# EAGLE design JouleMeter_new (EAGLE 6.2)
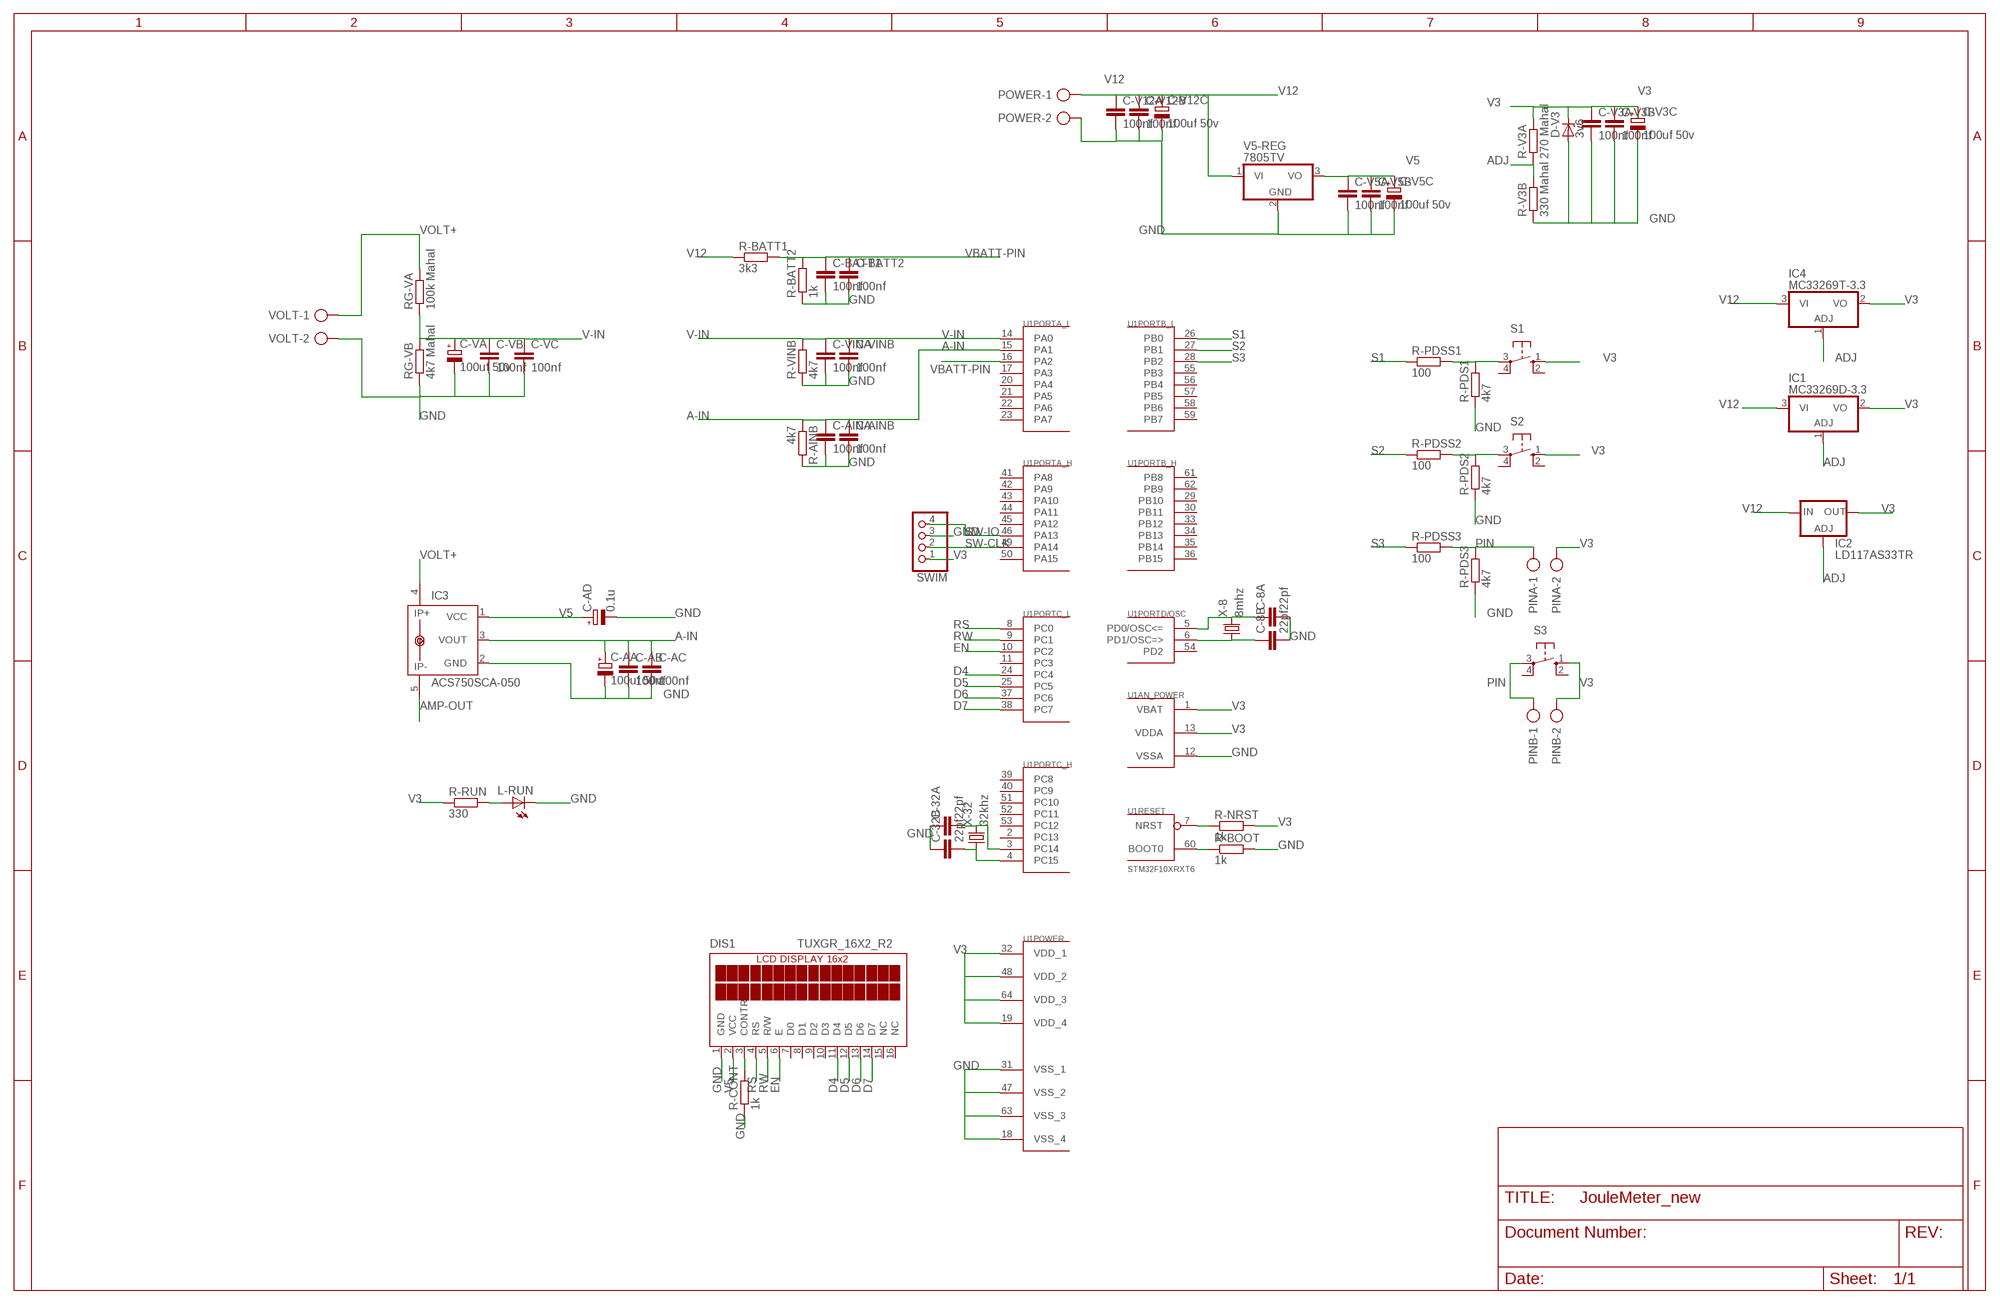
[diagram p0: schematic, sheet 1]

## Parts
C-8A  22pf  C-EU025-024X044  [C025-024X044]
C-8B  22pf  C-EU025-024X044  [C025-024X044]
C-32A  22pf  C-EU025-024X044  [C025-024X044]
C-32B  22pf  C-EU025-024X044  [C025-024X044]
C-AA  100uf 50v  CPOL-EUE2-5  [E2-5]
C-AB  100nf  C-EU050-024X044  [C050-024X044]
C-AC  100nf  C-EU050-024X044  [C050-024X044]
C-AD  0.1u  CPOL-EUE2-5  [E2-5]
C-AINA  100nf  C-EU050-024X044  [C050-024X044]
C-AINB  100nf  C-EU050-024X044  [C050-024X044]
C-BATT1  100nf  C-EU050-024X044  [C050-024X044]
C-BATT2  100nf  C-EU050-024X044  [C050-024X044]
C-V3A  100nf  C-EU050-024X044  [C050-024X044]
C-V3B  100nf  C-EU050-024X044  [C050-024X044]
C-V3C  100uf 50v  CPOL-EUE5-5  [E5-5]
C-V5A  100nf  C-EU050-024X044  [C050-024X044]
C-V5B  100nf  C-EU050-024X044  [C050-024X044]
C-V5C  100uf 50v  CPOL-EUE5-5  [E5-5]
C-V12A  100nf  C-EU050-024X044  [C050-024X044]
C-V12B  100nf  C-EU050-024X044  [C050-024X044]
C-V12C  100uf 50v  CPOL-EUE5-5  [E5-5]
C-VA  100uf 50v  CPOL-EUE2-5  [E2-5]
C-VB  100nf  C-EU050-024X044  [C050-024X044]
C-VC  100nf  C-EU050-024X044  [C050-024X044]
C-VINA  100nf  C-EU050-024X044  [C050-024X044]
C-VINB  100nf  C-EU050-024X044  [C050-024X044]
D-V3  3v6  ZENER-DIODEZD-7.5  [ZDIO-7.5]
DIS1  TUXGR_16X2_R2  [TUXGR_16X2_R2]
IC1  MC33269D-3.3  [DPACK]
IC2  LD117AS33TR  [SOT223]
IC3  ACS750SCA-050  [ACS75050]
IC4  MC33269T-3.3  [TO220V]
L-RUN  LED3MM  [LED3MM]
PINA  AK300/2  [AK300/2]
PINB  AK300/2  [AK300/2]
POWER  AK300/2  [AK300/2]
R-AINB  4k7  R-EU_0204/7  [0204/7]
R-BATT1  3k3  R-EU_0204/7  [0204/7]
R-BATT2  1k  R-EU_0204/7  [0204/7]
R-BOOT  1k  R-EU_0204/7  [0204/7]
R-CONT  1k  R-EU_0204/7  [0204/7]
R-NRST  1k  R-EU_0204/7  [0204/7]
R-PDS1  4k7  R-EU_0204/7  [0204/7]
R-PDS2  4k7  R-EU_0204/7  [0204/7]
R-PDS3  4k7  R-EU_0204/7  [0204/7]
R-PDSS1  100  R-EU_0204/7  [0204/7]
R-PDSS2  100  R-EU_0204/7  [0204/7]
R-PDSS3  100  R-EU_0204/7  [0204/7]
R-RUN  330  R-EU_0204/7  [0204/7]
R-V3A  270 Mahal  R-EU_0204/7  [0204/7]
R-V3B  330 Mahal  R-EU_0204/7  [0204/7]
R-VINB  4k7  R-EU_0204/7  [0204/7]
RG-VA  100k Mahal  R-EU_0204/7  [0204/7]
RG-VB  4k7 Mahal  R-EU_0204/7  [0204/7]
S1  10-XX  [B3F-10XX]
S2  10-XX  [B3F-10XX]
S3  40-XX  [B3F-40XX]
SWIM  PINHD-1X4  [1X04]
U1  STM32F10XRXT6  [TQFP64]
V5-REG  7805TV  [TO220V]
VOLT  AK300/2  [AK300/2]
X-8  8mhz  CRYSTALHC49U-V  [HC49U-V]
X-32  32khz  CRYSTALTC26V  [TC26V]

## Nets
A-IN: C-AA.+ C-AB.1 C-AC.1 C-AINA.1 C-AINB.1 IC3.3(VOUT) R-AINB.1 U1.15(PORTA_L:PA1)
ADJ: IC1.1(ADJ) IC2.1(ADJ) IC4.1(ADJ) R-V3A.1 R-V3B.2
AMP-OUT: IC3.5(IP-)
D4: DIS1.11(D4) U1.24(PORTC_L:PC4)
D5: DIS1.12(D5) U1.25(PORTC_L:PC5)
D6: DIS1.13(D6) U1.37(PORTC_L:PC6)
D7: DIS1.14(D7) U1.38(PORTC_L:PC7)
EN: DIS1.6(E) U1.10(PORTC_L:PC2)
GND: C-8A.2 C-8B.2 C-32A.1 C-32B.1 C-AA.- C-AB.2 C-AC.2 C-AD.- C-AINA.2 C-AINB.2 C-BATT1.2 C-BATT2.2 C-V3A.2 C-V3B.2 C-V3C.- C-V5A.2 C-V5B.2 C-V5C.- C-V12A.2 C-V12B.2 C-V12C.- C-VA.- C-VB.2 C-VC.2 C-VINA.2 C-VINB.2 D-V3.A DIS1.1(GND) IC3.2(GND) L-RUN.K(C) POWER.2 R-AINB.2 R-BATT2.1 R-BOOT.2 R-CONT.1 R-PDS1.1 R-PDS2.1 R-PDS3.1 R-V3B.1 R-VINB.1 RG-VB.1 SWIM.3 U1.12(AN_POWER:VSSA) U1.18(POWER:VSS_4) U1.31(POWER:VSS_1) U1.47(POWER:VSS_2) U1.63(POWER:VSS_3) V5-REG.2(GND) VOLT.2
N$3: R-PDS1.2 R-PDSS1.2 S1.3(P)
N$4: R-PDS2.2 R-PDSS2.2 S2.3(P)
N$8: DIS1.3(CONTR) R-CONT.2
N$29: C-32B.2 U1.4(PORTC_H:PC15) X-32.1
N$30: C-32A.2 U1.3(PORTC_H:PC14) X-32.2
N$34: C-8B.1 U1.6(PORTD/OSC:PD1/OSC=>) X-8.1
N$36: C-8A.1 U1.5(PORTD/OSC:PD0/OSC<=) X-8.2
N$41: R-NRST.1 U1.7(RESET:NRST)
N$42: R-BOOT.1 U1.60(RESET:BOOT0)
N$72: L-RUN.A R-RUN.2
PIN: PINA.1 PINB.1 R-PDS3.2 R-PDSS3.2 S3.3(P)
RS: DIS1.4(RS) U1.8(PORTC_L:PC0)
RW: DIS1.5(R/W) U1.9(PORTC_L:PC1)
S1: R-PDSS1.1 U1.26(PORTB_L:PB0)
S2: R-PDSS2.1 U1.27(PORTB_L:PB1)
S3: R-PDSS3.1 U1.28(PORTB_L:PB2)
SW-CLK: SWIM.2 U1.49(PORTA_H:PA14)
SW-IO: SWIM.4 U1.46(PORTA_H:PA13)
V3: C-V3A.1 C-V3B.1 C-V3C.+ D-V3.C IC1.2(VO) IC2.4(OUT) IC4.2(VO) PINA.2 PINB.2 R-NRST.2 R-RUN.1 R-V3A.2 S1.1(S) S2.1(S) S3.1(S) SWIM.1 U1.1(AN_POWER:VBAT) U1.13(AN_POWER:VDDA) U1.19(POWER:VDD_4) U1.32(POWER:VDD_1) U1.48(POWER:VDD_2) U1.64(POWER:VDD_3)
V5: C-AD.+ C-V5A.1 C-V5B.1 C-V5C.+ DIS1.2(VCC) IC3.1(VCC) V5-REG.3(VO)
V12: C-V12A.1 C-V12B.1 C-V12C.+ IC1.3(VI) IC2.3(IN) IC4.3(VI) POWER.1 R-BATT1.1 V5-REG.1(VI)
V-IN: C-VA.+ C-VB.1 C-VC.1 C-VINA.1 C-VINB.1 R-VINB.2 RG-VA.1 RG-VB.2 U1.14(PORTA_L:PA0)
VBATT-PIN: C-BATT1.1 C-BATT2.1 R-BATT1.2 R-BATT2.2 U1.16(PORTA_L:PA2)
VOLT+: IC3.4(IP+) RG-VA.2 VOLT.1
Unconnected: DIS1.7(D0) DIS1.8(D1) DIS1.9(D2) DIS1.10(D3) DIS1.15(NC) DIS1.16(NC) IC3.IP+1 IC3.IP-1 S1.2(S1) S1.4(P1) S2.2(S1) S2.4(P1) S3.2(S1) S3.4(P1) U1.2(PORTC_H:PC13) U1.11(PORTC_L:PC3) U1.17(PORTA_L:PA3) U1.20(PORTA_L:PA4) U1.21(PORTA_L:PA5) U1.22(PORTA_L:PA6) U1.23(PORTA_L:PA7) U1.29(PORTB_H:PB10) U1.30(PORTB_H:PB11) U1.33(PORTB_H:PB12) U1.34(PORTB_H:PB13) U1.35(PORTB_H:PB14) U1.36(PORTB_H:PB15) U1.39(PORTC_H:PC8) U1.40(PORTC_H:PC9) U1.41(PORTA_H:PA8) U1.42(PORTA_H:PA9) U1.43(PORTA_H:PA10) U1.44(PORTA_H:PA11) U1.45(PORTA_H:PA12) U1.50(PORTA_H:PA15) U1.51(PORTC_H:PC10) U1.52(PORTC_H:PC11) U1.53(PORTC_H:PC12) U1.54(PORTD/OSC:PD2) U1.55(PORTB_L:PB3) U1.56(PORTB_L:PB4) U1.57(PORTB_L:PB5) U1.58(PORTB_L:PB6) U1.59(PORTB_L:PB7) U1.61(PORTB_H:PB8) U1.62(PORTB_H:PB9)

## Library data of the parts
C-8A C-8B C-32A C-32B C-AB C-AC C-AINA C-AINB C-BATT1 C-BATT2 C-V3A C-V3B C-V5A C-V5B C-V12A C-V12B C-VB C-VC C-VINA C-VINB = resistor:C-EU: CAPACITOR, European symbol
C-AA C-AD C-V3C C-V5C C-V12C C-VA = resistor:CPOL-EU: POLARIZED CAPACITOR, European symbol
D-V3 = diode:ZENER-DIODE: Z-Diode
DIS1 = display-lcd:TUXGR_16X2_R2: Tuxgraphics LCD display 16x2 characters reflective, without background light Source: tuxgr_12x2_r2.pdf; OC_FARNELL: unknown; OC_NEWARK: unknown
IC1 IC4 = linear:MC33269?*: Adjustable Output Low Dropout Voltage Regulator 800 mA Source: http://www.onsemi.com/pub/Collateral/MC33269-D.PDF
IC2 = v-reg:LD117A?*: Low drop fixed and adjustable positive voltage regulators 1 A Source: http://www.st.com/stonline/products/literature/ds/7194/ld1117axx.pdf
IC3 = allegro:ACS750*CA-050: Current Sensor display layer 49 Reference in BRD and place VIAs on circles Source: www.allegromicro.com/datafile/0750-050.pdf; MF: ALLEGRO MICROSYSTEMS, INC.; MPN: ACS750SCA-050; OC_FARNELL: 1457175; OC_NEWARK: 81H6588
L-RUN = led:LED: LED OSRAM: - CHIPLED LG R971, LG N971, LY N971, LG Q971, LY Q971, LO R971, LY R971 LH N974, LH R974 LS Q976, LO Q976, LY Q976 LO Q996 - Hyper CHIPLED LW Q18S LB Q993, LB Q99A, LB R99A - SideLED LS A670, LO A670, LY A670, LG A670, LP A670 LB A673, LV A673, LT A673, LW A673 LH A674 LY A675 LS A676, LA A676, LO A676, LY A676, LW A676 LS A679, LY A679, LG A679 - Hyper Micro SIDELED® LS Y876, LA Y876, LO Y876, LY Y876 LT Y87S - SmartLED LW L88C, LW L88S LB L89C, LB L89S, LG L890 LS L89K, LO L89K, LY L89K LS L896, LA L896, LO L896, LY L896 - TOPLED LS T670, LO T670, LY T670, LG T670, LP T670 LSG T670, LSP T670, LSY T670, LOP T670, LYG T670 LG T671, LOG T671, LSG T671 LB T673, LV T673, LT T673, LW T673 LH T674 LS T676, LA T676, LO T676, LY T676, LB T676, LH T676, LSB T676, LW T676 LB T67C, LV T67C, LT T67C, LS T67K, LO T67K, LY T67K, LW E67C LS E67B, LA E67B, LO E67B, LY E67B, LB E67C, LV E67C, LT E67C LW T67C LS T679, LY T679, LG T679 LS T770, LO T770, LY T770, LG T770, LP T770 LB T773, LV T773, LT T773, LW T773 LH T774 LS E675, LA E675, LY E675, LS T675 LS T776, LA T776, LO T776, LY T776, LB T776 LHGB T686 LT T68C, LB T68C - Hyper Mini TOPLED® LB M676 - Mini TOPLED Santana® LG M470 LS M47K, LO M47K, LY M47K Source: http://www.osram.convergy.de LUXEON: - LUMILED® LXK2-PW12-R00, LXK2-PW12-S00, LXK2-PW14-U00, LXK2-PW14-V00 LXK2-PM12-R00, LXK2-PM12-S00, LXK2-PM14-U00 LXK2-PE12-Q00, LXK2-PE12-R00, LXK2-PE12-S00, LXK2-PE14-T00, LXK2-PE14-U00 LXK2-PB12-K00, LXK2-PB12-L00, LXK2-PB12-M00, LXK2-PB14-N00, LXK2-PB14-P00, LXK2-PB14-Q00 LXK2-PR12-L00, LXK2-PR12-M00, LXK2-PR14-Q00, LXK2-PR14-R00 LXK2-PD12-Q00, LXK2-PD12-R00, LXK2-PD12-S00 LXK2-PH12-R00, LXK2-PH12-S00 LXK2-PL12-P00, LXK2-PL12-Q00, LXK2-PL12-R00 Source: www.luxeon.com KINGBRIGHT: KA-3528ASYC Source: www.kingbright.com
PINA PINB POWER VOLT = con-ptr500:AK300/2: CONNECTOR; OC_FARNELL: unknown; OC_NEWARK: unknown
R-AINB R-BATT1 R-BATT2 R-BOOT R-CONT R-NRST R-PDS1-R-PDS3 R-PDSS1-R-PDSS3 R-RUN R-V3A R-V3B R-VINB RG-VA RG-VB = resistor:R-EU_: RESISTOR, European symbol
S1 S2 = switch-omron:10-XX: OMRON SWITCH; MPN: B3F-1000; OC_FARNELL: 176432; OC_NEWARK: 36M3542
S3 = switch-omron:40-XX: OMRON SWITCH; MF: OMRON COMPONENTS USA; MPN: B3F-4000; OC_FARNELL: 176434; OC_NEWARK: 36K3105
SWIM = pinhead:PINHD-1X4: PIN HEADER
U1 = stm32:STM32F10XRXT6: STM32F101/103 64pin LQFP
V5-REG = linear:78*: Positive VOLTAGE REGULATOR Source: http://cache.national.com/ds/LM/LM78L05.pdf http://www.fairchildsemi.com/ds/LM/LM7805.pdf
X-8 = crystal:CRYSTAL: CRYSTAL; OC_FARNELL: 1666969; OC_NEWARK: unknown
X-32 = crystal:CRYSTAL: CRYSTAL; OC_FARNELL: unknown; OC_NEWARK: unknown

## Board
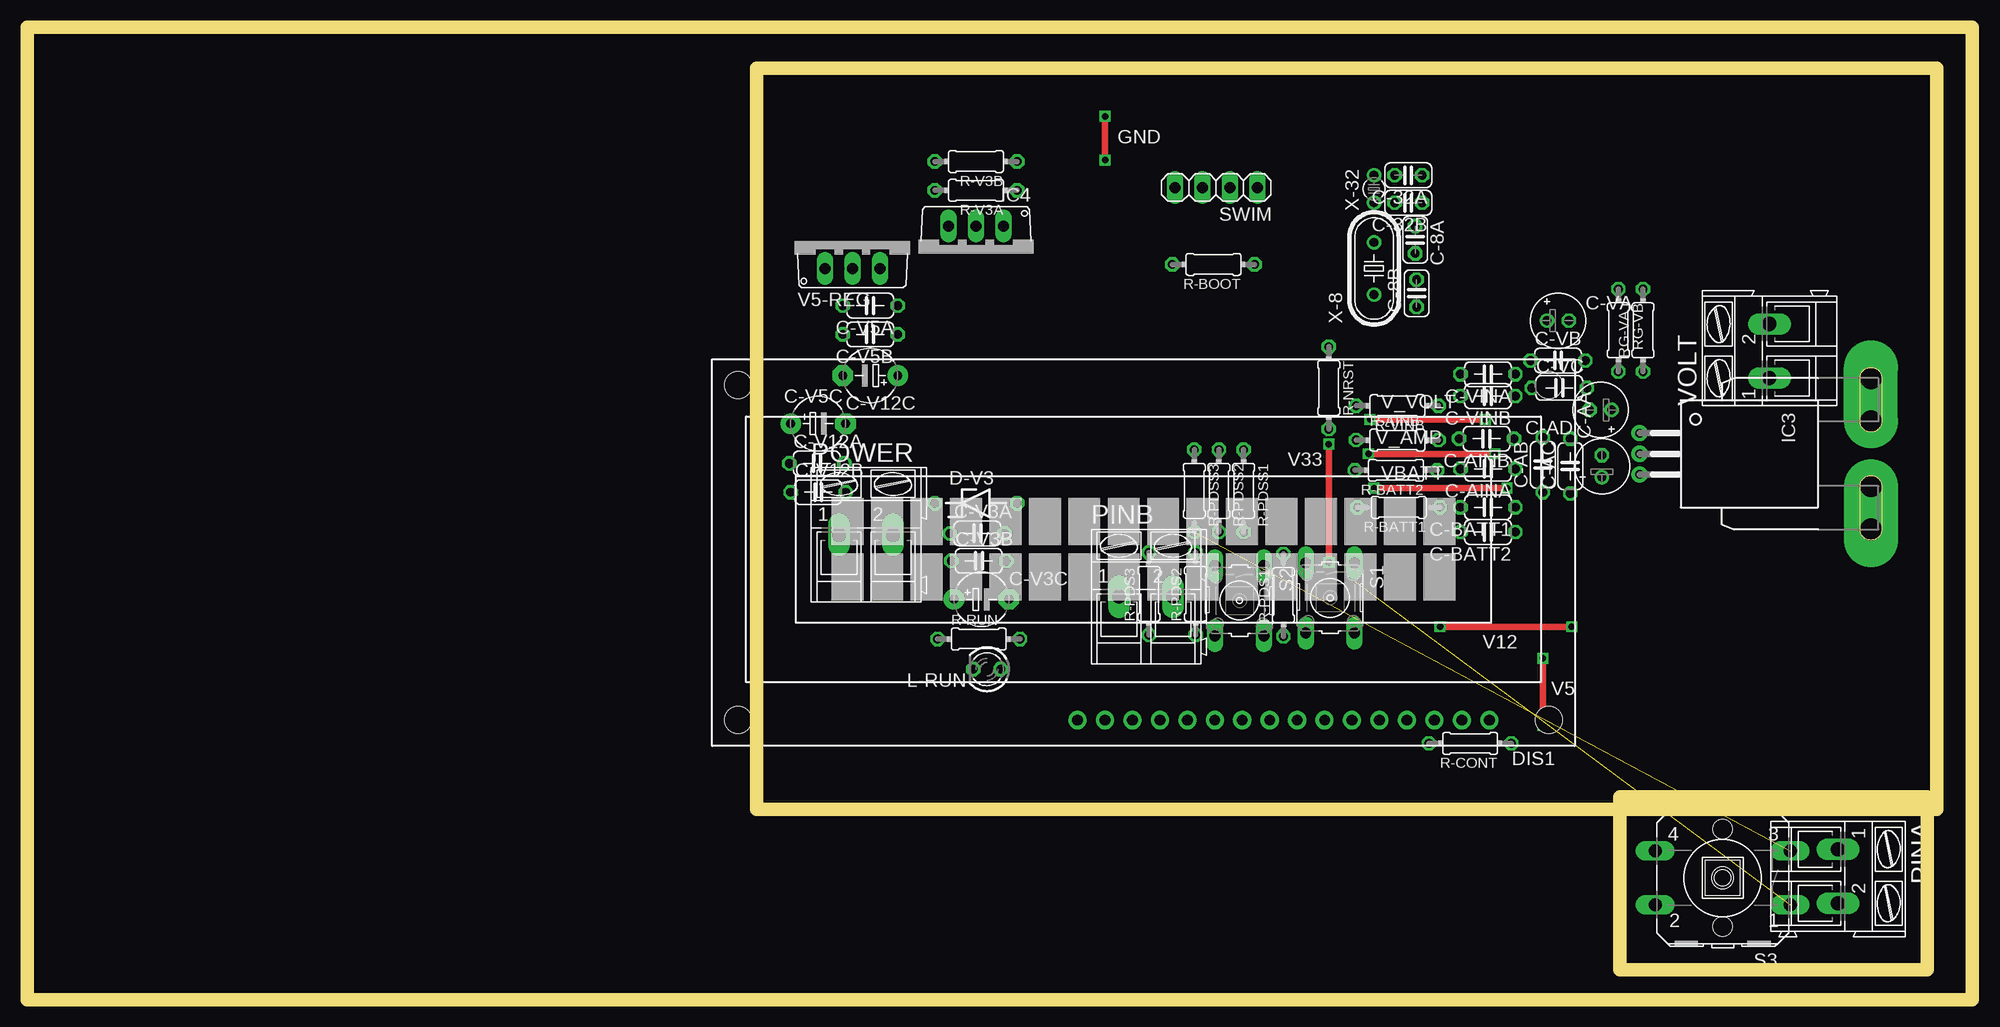
[diagram p1: board, top side]
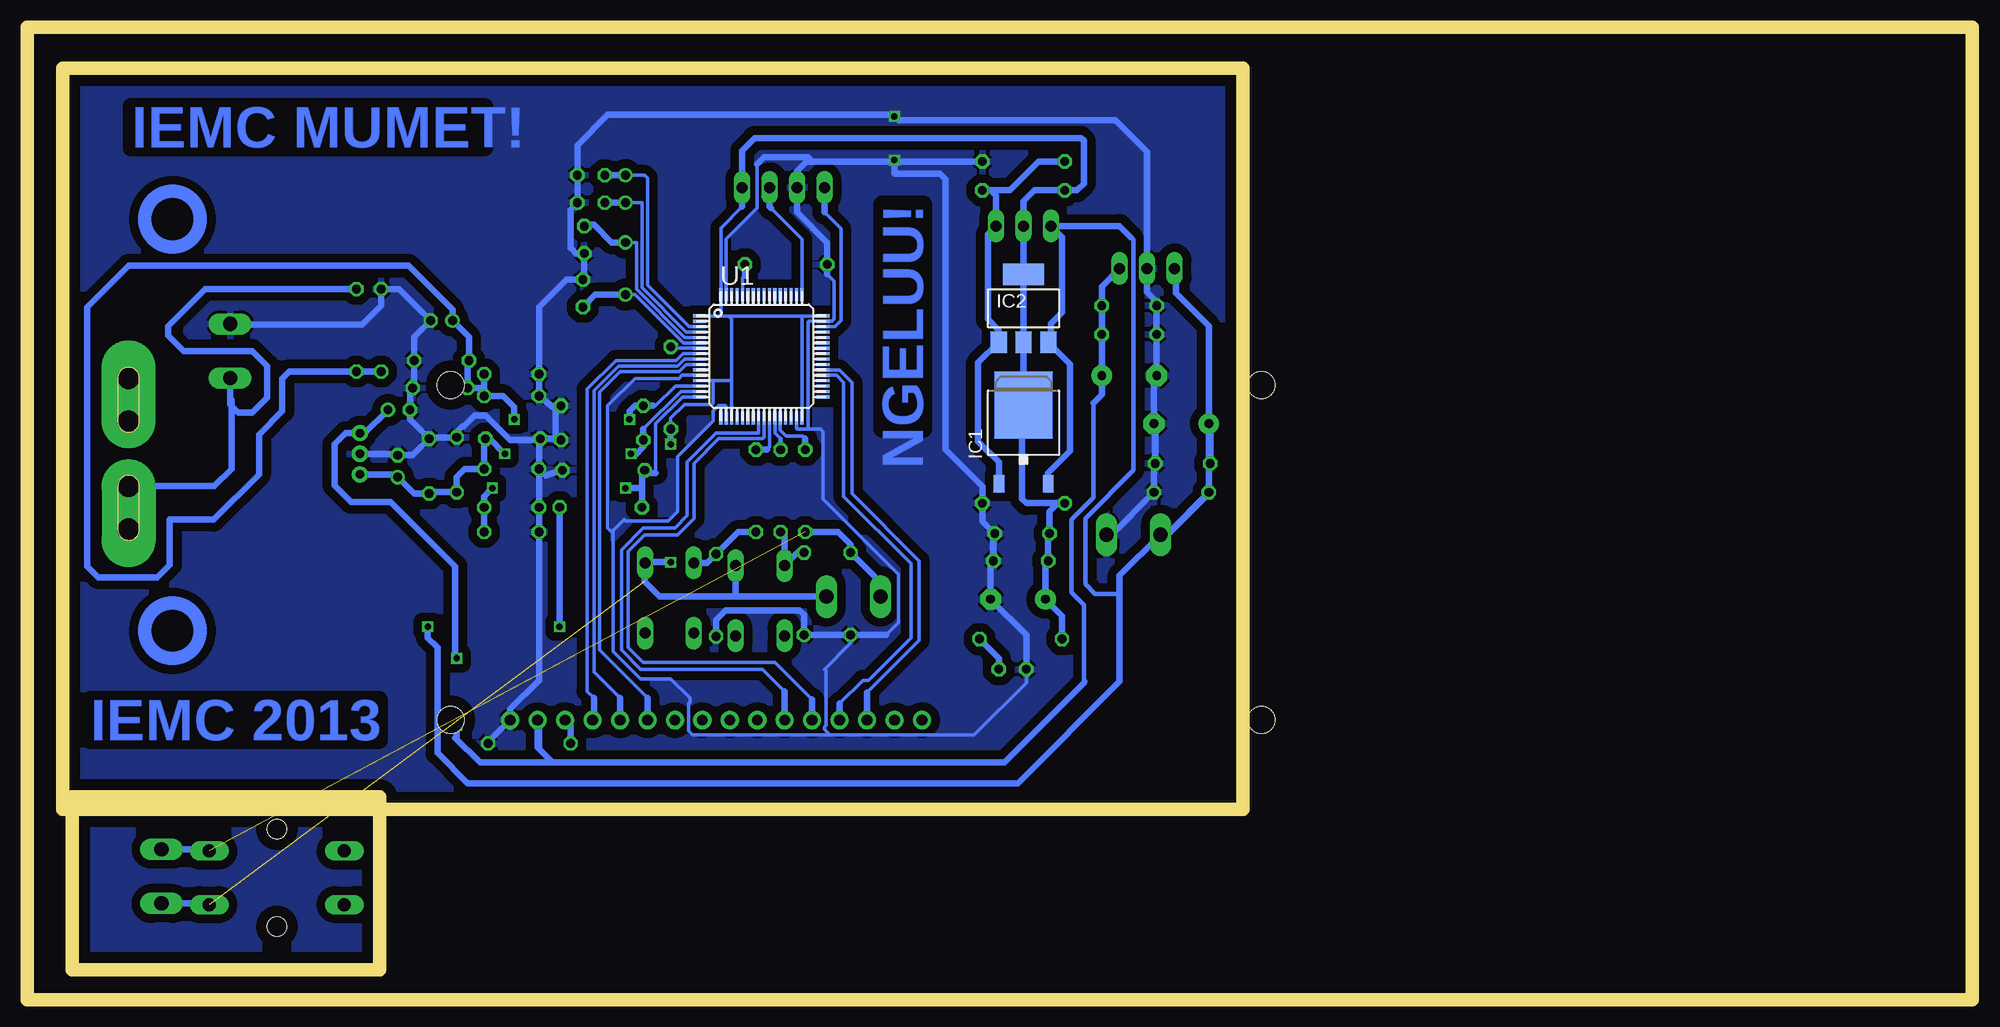
[diagram p2: board, bottom side, seen from below]

Size 180 x 90 mm. Coordinates in mm from the lower left corner, seen from the top.
Outline: 175.81,18.75 175.81,2.75 147.36,2.75 147.36,18.75 175.81,18.75
Outline: 0,90 180,90 180,0 0,0 0,90
Outline: 67.48,86.19 176.7,86.19 176.7,17.61 67.48,17.61 67.48,86.19
Copper layers (1*16): Top 0.035mm / dielectric 1.5mm / Bottom 0.035mm
Design rules: minimum track width 10mil, minimum drill 24mil, track to track 8mil, track to pad 8mil, pad to pad 8mil, via to via 8mil, smd to smd 8mil, copper to edge 40mil, drill to drill 8mil, minimum pad ring 10mil, minimum via ring 8mil, stop-mask expansion 4mil, vias tented up to drill 0mil, thermal gap 10mil

### Footprints (pad centres in the part's own frame; a part is rotated, then mirrored left to right if it is on the bottom)
C025-024X044 = drill 0.813 octagon: 1 -1.27,0; 2 1.27,0
E2-5 = drill 0.813 pad 1.27: + -1.016,0 | drill 0.813 pad 1.27 octagon: - 1.016,0
C050-024X044 = drill 0.813 octagon: 1 -2.54,0; 2 2.54,0
E5-5 = drill 0.813 pad 1.905: + -2.54,0 | drill 0.813 pad 1.905 octagon: - 2.54,0
ZDIO-7.5 = drill 0.813 octagon: A 3.81,0; C -3.81,0
TUXGR_16X2_R2 = drill 1 pad 1.676: 1 -32,15.5; 2 -29.46,15.5; 3 -26.92,15.5; 4 -24.38,15.5; 5 -21.84,15.5; 6 -19.3,15.5; 7 -16.76,15.5; 8 -14.22,15.5; 9 -11.68,15.5; 10 -9.14,15.5; 11 -6.6,15.5; 12 -4.06,15.5; 13 -1.52,15.5; 14 1.02,15.5; 15 3.56,15.5; 16 6.1,15.5 | hole 2.5: -37.5,-15.5; 37.5,-15.5; -37.5,15.5; 37.5,15.5
DPACK = smd 1 x 1.6: 1 -2.28,-4.8; 3 2.28,-4.8 | smd 5.4 x 6.2: 2 0,2.5
SOT223 = smd 1.5 x 2: 1 -2.3,-3.15; 2 0,-3.15; 3 2.3,-3.15 | smd 3.8 x 2: 4 0,3.15
ACS75050 = drill 0.8 pad 1.5: 1 -1.91,-21.4; 2 0,-21.4; 3 1.91,-21.4 | drill 2 pad 5 offset: 4 3,0; 5 -3,0 | drill 2 pad 4 offset: IP+1 7,0; IP-1 -7,0
TO220V = drill 1.016 long: 1 -2.54,-2.54; 2 0,-2.54; 3 2.54,-2.54
LED3MM = drill 0.813 octagon: A -1.27,0; K 1.27,0
AK300/2 = drill 1.321 long: 1 -2.515,0; 2 2.489,0
0204/7 = drill 0.813 octagon: 1 -3.81,0; 2 3.81,0
B3F-10XX = drill 1.016 long: 1 -3.251,2.261; 2 3.251,2.261; 3 -3.251,-2.261; 4 3.251,-2.261
B3F-40XX = drill 1.194 long: 1 -6.248,2.489; 2 6.248,2.489; 3 -6.248,-2.489; 4 6.248,-2.489 | hole 1.803: 0,-4.496; 0,4.496
1X04 = drill 1.016 long: 1 -3.81,0; 2 -1.27,0; 3 1.27,0; 4 3.81,0
TQFP64 = smd 1.2 x 0.3: 1 -5.7,3.75; 2 -5.7,3.25; 3 -5.7,2.75; 4 -5.7,2.25; 5 -5.7,1.75; 6 -5.7,1.25; 7 -5.7,0.75; 8 -5.7,0.25; 9 -5.7,-0.25; 10 -5.7,-0.75; 11 -5.7,-1.25; 12 -5.7,-1.75; 13 -5.7,-2.25; 14 -5.7,-2.75; 15 -5.7,-3.25; 16 -5.7,-3.75; 33 5.7,-3.75; 34 5.7,-3.25; 35 5.7,-2.75; 36 5.7,-2.25; 37 5.7,-1.75; 38 5.7,-1.25; 39 5.7,-0.75; 40 5.7,-0.25; 41 5.7,0.25; 42 5.7,0.75; 43 5.7,1.25; 44 5.7,1.75; 45 5.7,2.25; 46 5.7,2.75; 47 5.7,3.25; 48 5.7,3.75 | smd 0.3 x 1.2: 17 -3.75,-5.7; 18 -3.25,-5.7; 19 -2.75,-5.7; 20 -2.25,-5.7; 21 -1.75,-5.7; 22 -1.25,-5.7; 23 -0.75,-5.7; 24 -0.25,-5.7; 25 0.25,-5.7; 26 0.75,-5.7; 27 1.25,-5.7; 28 1.75,-5.7; 29 2.25,-5.7; 30 2.75,-5.7; 31 3.25,-5.7; 32 3.75,-5.7; 49 3.75,5.7; 50 3.25,5.7; 51 2.75,5.7; 52 2.25,5.7; 53 1.75,5.7; 54 1.25,5.7; 55 0.75,5.7; 56 0.25,5.7; 57 -0.25,5.7; 58 -0.75,5.7; 59 -1.25,5.7; 60 -1.75,5.7; 61 -2.25,5.7; 62 -2.75,5.7; 63 -3.25,5.7; 64 -3.75,5.7
HC49U-V = drill 0.813: 1 -2.413,0; 2 2.413,0
TC26V = drill 0.813: 1 -1.27,0; 2 1.27,0

### Placement (x,y rotation side)
C-8A  128.44,70.31 270 top
C-8B  128.57,65.36 90 top
C-32A  127.81,76.28 180 top
C-32B  127.81,73.74 180 top
C-AA  145.71,49.36 90 top
C-AB  140.25,49.49 90 top
C-AC  142.79,49.36 90 top
C-AD  145.59,54.57 180 top
C-AINA  135.17,49.11 180 top
C-AINB  135.04,51.9 180 top
C-BATT1  135.17,45.55 180 top
C-BATT2  135.17,43.26 180 top
C-V3A  87.93,43.14 0 top
C-V3B  88.05,40.6 0 top
C-V3C  88.31,37.04 0 top
C-V5A  78.02,64.22 180 top
C-V5B  78.02,61.55 180 top
C-V5C  78.02,57.74 180 top
C-V12A  73.07,49.61 0 top
C-V12B  73.19,46.95 0 top
C-V12C  73.19,53.3 0 top
C-VA  141.65,62.82 0 top
C-VB  141.65,59.14 0 top
C-VC  141.78,56.6 0 top
C-VINA  135.17,57.87 180 top
C-VINB  135.17,55.84 180 top
D-V3  87.8,45.93 0 top
DIS1  103.29,41.36 180 top
IC1  87.8,52.53 0 bottom
IC2  87.8,63.97 0 bottom
IC3  170.6,50.5 270 top
IC4  87.8,69.05 180 top
L-RUN  88.82,30.56 180 top
PINA  167.56,11.39 270 top
PINB  103.55,37.3 0 top
POWER  77.64,43.01 0 top
R-AINB  126.79,51.77 0 top
R-BATT1  126.92,45.55 180 top
R-BATT2  126.66,48.98 180 top
R-BOOT  109.77,68.03 180 top
R-CONT  133.52,23.71 180 top
R-NRST  120.44,56.6 270 top
R-PDS1  116.25,37.42 90 top
R-PDS2  108.12,37.55 90 top
R-PDS3  103.8,37.55 90 top
R-PDSS1  112.56,47.07 270 top
R-PDSS2  110.28,47.07 270 top
R-PDSS3  107.99,47.07 270 top
R-RUN  88.05,33.36 0 top
R-V3A  87.8,74.89 180 top
R-V3B  87.8,77.55 180 top
R-VINB  126.79,54.95 180 top
RG-VA  149.52,61.93 90 top
RG-VB  147.24,61.93 270 top
S1  120.57,37.17 270 top
S2  112.18,36.91 270 top
S3  156.89,11.26 180 top
SWIM  110.03,75.14 180 top
U1  112.06,59.52 0 bottom
V5-REG  76.37,70.19 0 top
VOLT  161.21,60.03 90 top
X-8  124.63,67.65 90 top
X-32  124.63,75.01 90 top

### Tracks (layer width: path | path; a pad name or v marks a point on that pad's centre or on a via)
A-IN  (via drill 0.6)
  Top 0.61: v135.81,50.5 v124.12,50.5
  Bottom 0.305: U1.15 119.5,56.27 122.98,52.79
  Bottom 0.61: IC3.3 145.96,48.59 C-AA.+ 144.19,46.82 C-AC.1 142.66,46.95 C-AB.1 140.25,48.34 139.49,49.11 C-AINA.1 137.71,51.77 C-AINB.1 137.2,51.9 v135.81,50.5 | 122.98,52.79 R-AINB.1 122.98,51.14 123.61,50.5 v124.12,50.5
ADJ
  Bottom 0.61: R-V3B.2 86.4,77.55 89.07,74.89 90.85,74.89 | 90.85,74.89 R-V3A.1 | 90.85,74.89 90.34,74.38 IC4.1 91.1,70.82 91.1,62.95 90.1,61.95 IC2.1 91.99,58.92 91.99,51.65 90.08,49.73 IC1.1
D4
  Bottom 0.305: U1.24 112.31,52.41 116.25,52.41 118.91,49.74 118.91,44.79 120.06,43.65 122.98,43.65 125.01,41.61 125.01,32.34 123.23,30.56 111.93,30.56 109.9,28.53
  Bottom 0.61: 109.9,28.53 DIS1.11
D5
  Bottom 0.305: U1.25 111.81,52.02 111.93,51.9 115.99,51.9 118.28,49.61 118.28,44.53 119.8,43.01 122.85,43.01 124.38,41.49 124.38,32.6 122.98,31.2 110.79,31.2 107.36,27.77
  Bottom 0.61: 107.36,27.77 DIS1.12
D6
  Bottom 0.305: U1.37 105.1,57.77 104.44,57.11 104.44,46.57 98.21,40.34 98.21,33.48 102.15,29.55 102.66,29.55 104.82,27.39
  Bottom 0.61: 104.82,27.39 DIS1.13
D7
  Bottom 0.305: U1.38 104.84,58.27 103.68,57.11 103.68,46.82 97.45,40.6 97.45,33.23 102.28,28.41
  Bottom 0.61: 102.28,28.41 DIS1.14
EN
  Bottom 0.305: U1.10 119.03,58.77 119.68,58.12 125.14,58.12 127.04,56.22 127.04,32.34 122.6,27.9
  Bottom 0.61: 122.6,27.9 DIS1.6
GND  (via drill 0.6)
  Top 0.61: v99.74,81.75 v99.74,77.68 99.87,77.55
  Bottom 0: 108.75,52.79 106.6,52.79 | 100.5,33.74 103.68,33.74 103.8,33.61 | 106.22,30.56 106.22,24.98 | 105.83,24.47 105.71,24.47 | R-VINB.1 130.6,54.82 | 130.6,54.82 130.85,54.57 C-VINB.2 | 130.6,54.82 131.49,54.82 131.74,55.08 131.87,55.08 132.5,55.71 132.5,64.09 129.96,66.63 128.69,66.63 128.57,66.76 128.57,68.92 C-8A.2 | 129.58,69.43 129.58,73.36 129.2,73.74 129.2,76.28 129.07,76.41 | 75.86,46.95 75.86,58.25 75.48,58.63 75.48,64.6 | 76.37,65.49 76.37,67.78 | 126.28,54.95 126.28,43.52 125.77,43.01 125.77,32.34 123.11,29.67 | 118.41,24.47 92.25,24.47 91.86,24.85 91.86,25.1 87.55,29.42 87.55,33.74 87.55,33.87 90.85,37.17 90.85,43.52 91.48,44.15 91.48,45.93 91.61,46.06
  Bottom 0.305: 105.96,67.14 105.33,66.5 105.33,62.95 105.5,62.77 U1.47 107.66,62.77 107.74,62.7 107.74,52.79 | R-PDS3.1 103.8,33.61 103.8,32.98 106.22,30.56 106.09,30.44 106.09,25.36 106.22,25.23 106.22,24.98 105.71,24.47 | 105.71,24.47 92.37,24.47 87.55,29.29 87.55,29.42 L-RUN.K | U1.31 108.81,52.84 108.75,52.79 107.74,52.79 | 107.74,52.79 106.6,52.79 106.34,52.53 106.34,46.31 99.36,39.33 99.36,34.88 100.5,33.74 | U1.63 115.31,70.37 112.44,73.24 112.44,77.3 | U1.18 115.31,54.9 115.36,54.95 115.99,54.95 116.5,54.44 116.5,53.55 119.8,50.25 119.8,45.17 120.69,44.28 124.63,44.28 124.76,44.41 125.77,43.39 125.77,43.14 | U1.12 119.4,57.77 119.68,57.49 123.74,57.49 126.28,54.95 126.28,43.65 125.77,43.14 | 105.71,24.47 118.41,24.47 118.79,24.85 118.79,27.39 118.66,27.52 118.66,27.9 120.44,29.67 123.11,29.67 123.23,29.67 125.77,32.22 125.77,43.01 125.77,43.14
  Bottom 0.61: R-PDS1.1 116.25,35.14 115.36,36.02 108.5,36.02 108.12,35.64 R-PDS2.1 R-PDS3.1 100.5,33.74 | R-CONT.1 137.33,23.82 DIS1.1 135.3,26.88 132.63,29.55 C-BATT2.2 C-BATT1.2 C-AINA.2 | C-32A.1 C-32B.1 129.71,73.11 129.71,69.55 129.58,69.43 129.2,69.05 C-8A.2 128.44,66.76 C-8B.2 129.96,66.63 130.09,66.63 132.63,64.09 C-VINA.2 C-VINB.2 130.98,54.57 R-VINB.1 131.11,54.44 131.11,51.9 | C-AINA.2 132.63,51.77 | R-BATT2.1 132,48.47 C-AINA.2 | 131.11,51.9 C-AINB.2 132.63,51.77 | IC3.2 145.84,50.5 C-AA.- 144.31,50.38 C-AC.2 | C-AC.2 142.66,52.03 C-AB.2 140.25,52.53 139.74,53.04 139.62,53.04 138.6,54.06 137.58,54.06 135.3,51.77 132.63,51.77 | C-AC.2 144.57,53.68 C-AD.- 144.57,56.34 C-VC.2 144.19,56.73 C-VB.2 144.19,61.3 C-VA.- 145.59,65.74 RG-VB.1 147.24,64.22 149.01,62.44 161.13,62.44 VOLT.2 | 105.96,67.14 R-BOOT.2 105.96,70.06 108.75,72.86 SWIM.3 108.75,76.66 107.87,77.55 107.36,77.55 | R-V3B.1 107.36,77.55 | L-RUN.K 87.55,33.74 C-V3C.- 90.85,37.17 90.85,40.34 C-V3B.2 90.59,43.01 C-V3A.2 91.48,44.15 91.61,44.28 D-V3.A | C-V12B.2 75.74,49.49 C-V12A.2 75.61,53.17 C-V12C.- 75.74,57.49 C-V5C.- 75.48,58.63 C-V5B.2 C-V5A.2 75.48,64.6 76.37,65.49 V5-REG.2 | 75.86,46.95 C-V12B.2 | 112.44,77.3 111.8,77.94 107.74,77.94 107.36,77.55 | 131.11,51.9 130.73,51.9 R-AINB.2 | 129.07,76.41 129.07,79.08 126.28,81.87 99.87,81.87 v99.74,81.75 99.36,81.36 79.29,81.36 76.37,78.44 76.37,67.78 | 91.61,46.06 91.61,47.45 95.04,50.88 95.04,75.9 95.55,76.41 99.74,76.41 v99.74,77.68 | POWER.2 79.67,43.01 C-V12B.2
  pour Bottom (isolate 0.813): 68.12,85.94 176.45,85.94 176.45,17.99 68.12,17.99
N$1
  pour Bottom (isolate 0.813): 147.36,3.26 147.36,18.75 175.81,18.75 175.81,3.26
N$3
  Bottom 0.61: R-PDSS1.2 114.22,43.26 R-PDS1.2 117.06,40.42 S1.3
N$4
  Bottom 0.61: R-PDSS2.2 109.92,42.91 S2.3 108.73,41.36 R-PDS2.2
N$8
  Bottom 0.61: R-CONT.2 129.71,25.36 DIS1.3
N$29
  Bottom 0.305: U1.4 119.01,61.77 123.11,65.87 123.11,73.74 X-32.1
  Bottom 0.61: X-32.1 C-32B.2
N$30
  Bottom 0.305: U1.3 118.74,62.27 122.6,66.12 122.6,76.03 122.85,76.28 X-32.2
  Bottom 0.61: X-32.2 C-32A.2
N$34
  Bottom 0.305: U1.6 119.28,60.77 123.74,65.23 X-8.1
  Bottom 0.61: X-8.1 127.42,65.23 C-8B.1
N$36
  Bottom 0.305: U1.5 119.14,61.27 123.61,65.74 123.61,70.06 X-8.2
  Bottom 0.61: X-8.2 125.9,70.06 127.55,71.71 128.31,71.71 C-8A.1
N$41
  Bottom 0.305: U1.7 119.41,60.27 119.42,60.28 120.31,60.28 R-NRST.1
N$42
  Bottom 0.305: U1.60 113.81,66.79 113.58,67.01
  Bottom 0.61: 113.58,67.01 R-BOOT.1
N$72
  Bottom 0.61: L-RUN.A 90.09,31.58 R-RUN.2
PIN  (1 unrouted)
  Bottom 0.61: R-PDSS3.2 104.94,43.26 103.8,42.12 R-PDS3.2 101.03,38.59 PINB.1 | PINA.1 163.29,13.9 S3.3
RS
  Bottom 0.305: U1.8 119.3,59.77 119.93,59.14 125.52,59.14 128.19,56.47 128.19,28.53 127.55,27.9
  Bottom 0.61: 127.55,27.9 127.55,25.98 DIS1.4
RW
  Bottom 0.305: U1.9 119.16,59.27 119.8,58.63 125.26,58.63 127.55,56.34 127.55,30.31 125.14,27.9
  Bottom 0.61: 125.14,27.9 DIS1.5
S1
  Bottom 0.305: U1.26 111.31,51.13 111.55,50.88
  Bottom 0.61: 111.55,50.88 R-PDSS1.1
S2
  Bottom 0.305: U1.27 110.81,52.43 110.28,51.9
  Bottom 0.406: 110.28,51.9 R-PDSS2.1
S3
  Bottom 0.305: U1.28 110.31,52.69 109.77,52.15 108.25,52.15 107.99,51.9
  Bottom 0.61: 107.99,51.9 R-PDSS3.1
SW-CLK
  Bottom 0.305: U1.49 108.31,70.38 111.17,73.24
  Bottom 0.61: SWIM.2 111.29,73.36 111.17,73.24
SW-IO
  Bottom 0.305: U1.46 105.24,62.27 104.69,62.82 104.69,71.33 106.22,72.86
  Bottom 0.61: 106.22,72.86 SWIM.4
V3  (via drill 0.6)  (1 unrouted)
  Top 0.61: v120.44,51.39 v120.44,40.47
  Bottom 0.305: 113.84,73.36 115.81,71.39 U1.64 115.81,63.34 115.74,63.27 | U1.48 108.5,63.27 | 108.5,63.27 115.1,63.27 | 115.1,63.27 115.74,63.27 | 115.74,63.27 U1.1 | U1.32 108.31,63.08 108.5,63.27 | U1.19 114.81,57.11 | 114.81,57.11 114.81,62.97 115.1,63.27 | U1.13 116.38,57.27 | 116.38,57.27 114.97,57.27 114.81,57.11 | R-NRST.2 120.44,53.8 119.17,55.08 116.63,55.08 116.5,55.2 116.5,57.14 116.38,57.27
  Bottom 0.61: PINB.2 114.22,37.3 | 114.22,37.3 121.46,37.3 122.85,38.69 122.85,40.39 S1.1 122.78,40.47 v120.44,40.47 | S2.1 114.44,37.52 114.22,37.3 | 113.84,73.36 SWIM.1 113.84,78.57 112.69,79.71 82.47,79.71 82.21,79.46 82.21,75.52 82.85,74.89 R-V3A.2 86.78,74.89 87.8,73.87 IC4.2 IC2.4 IC1.2 87.93,54.91 87.93,46.31 87.55,45.93 84.62,45.93 | D-V3.C 84.62,45.93 | 84.62,45.93 85.39,45.17 C-V3A.1 85.51,43.01 C-V3B.1 85.77,40.34 C-V3C.+ 84.24,35.52 R-RUN.1 | PINA.2 163.26,8.9 S3.1 | R-NRST.2 v120.44,51.39
V5  (via drill 0.6)
  Top 0.61: v140.25,31.58 v140.25,25.36
  Bottom 0.406: 81.32,55.2 81.32,46.44 83.35,44.41 83.35,37.68 82.21,36.53 82.21,29.55 82.09,29.42 82.21,29.29
  Bottom 0.61: C-AD.+ 148.75,52.41 IC3.1 150.54,52.41 151.55,51.39 151.55,47.58 150.03,46.06 146.35,46.06 140.38,40.09 140.38,31.71 v140.25,31.58 | V5-REG.3 80.56,66 C-V5A.1 C-V5B.1 C-V5C.+ 80.56,55.96 81.32,55.2 | 82.21,29.29 89.58,21.93 131.36,21.93 | 131.36,21.93 132.63,23.2 | 132.63,23.2 132.63,25.74 DIS1.2 132.75,23.32 132.63,23.2 | 131.36,21.93 138.09,21.93 140.38,24.21 140.25,24.34 v140.25,25.36
V12  (via drill 0.6)
  Top 0.61: v130.73,34.5 v142.92,34.5
  Bottom 0.406: 77.89,70.57 77.64,70.31 77.64,48.98 82.09,44.53 82.09,38.44 81.2,37.55 78.91,37.55
  Bottom 0.61: IC1.3 85.52,48.72 83.48,50.76 83.48,58.8 IC2.3 85.26,61.05 85.26,62.57 84.24,63.58 84.24,70.57 IC4.3 78.91,71.59 77.89,70.57 | C-V12C.+ 70.53,53.17 C-V12A.1 70.66,49.49 C-V12B.1 74.59,43.01 POWER.1 | POWER.1 74.47,43.01 70.66,46.82 70.66,62.31 73.7,65.36 73.7,67.52 V5-REG.1 | R-BATT1.1 v130.73,34.5 | v142.92,34.5 142.92,33.48 142.03,32.6 142.03,22.82 139.24,20.02 88.31,20.02 78.91,29.42 78.91,37.55 78.91,39.23 POWER.1
V-IN  (via drill 0.6)
  Top 0.61: v124.25,53.68 v134.92,53.68
  Bottom 0.305: U1.14 120.01,56.77 121.84,54.95 122.09,54.95
  Bottom 0.61: 122.09,54.95 R-VINB.2 123.74,54.95 124.25,54.44 v124.25,53.68 | RG-VA.1 RG-VB.2 155.75,58.12 156.38,57.49 156.38,54.44 158.54,52.28 158.54,48.6 162.73,44.41 166.79,44.41 166.79,40.22 167.94,39.07 173.4,39.07 174.41,40.09 174.41,64.09 170.6,67.9 144.7,67.9 140.63,63.84 C-VA.+ 139.11,61.3 C-VB.1 139.24,59.01 C-VC.1 137.84,56.6 137.71,56.47 | 137.71,56.47 C-VINB.1 135.93,55.84 134.92,54.82 v134.92,53.68 | 137.71,56.47 C-VINA.1
VBATT-PIN  (via drill 0.6)
  Top 0.61: v136.95,47.33 v124.63,47.33
  Bottom 0.305: U1.16 119.36,55.77 121.84,53.3 121.84,48.73
  Bottom 0.61: C-BATT2.1 C-BATT1.1 137.71,46.57 v136.95,47.33 | 121.84,48.73 122.6,48.73 R-BATT2.2 123.11,48.73 123.11,47.33 | R-BATT1.2 123.11,47.33 | v124.63,47.33 123.11,47.33
VOLT+
  Bottom 0.61: RG-VA.2 163.49,65.74 166.92,62.31 166.92,61.42 165.52,60.03 159.17,60.03 157.78,58.63 157.78,55.71 159.17,54.31 160.44,54.31 161.21,55.08 161.21,55.58 | 161.21,55.58 VOLT.1 | IC3.4 162.68,47.5 161.08,49.11 161.08,55.46 161.21,55.58
(copper drawn outside any net)
  shapes: Bottom circle x2

### Text on the board
Bottom: IEMC MUMET! | NGELUU! | IEMC 2013
tPlace: GND | V_VOLT | V_AMP | V33 | VBATT | V12 | V5